# EAGLE schematic battery-breakout (EAGLE 6.2)
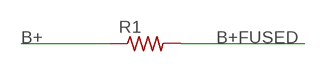
[diagram p0: schematic, sheet 1]

## Parts
R1  R-US_1206-A  [1206-A]

## Nets
B+: R1.1
B+FUSED: R1.2

## Library data of the parts
R1 = rcl_custom:R-US_: RESISTOR, American symbol